# Altium schematic sheet MAGI'sRTC.SchDoc
size A4
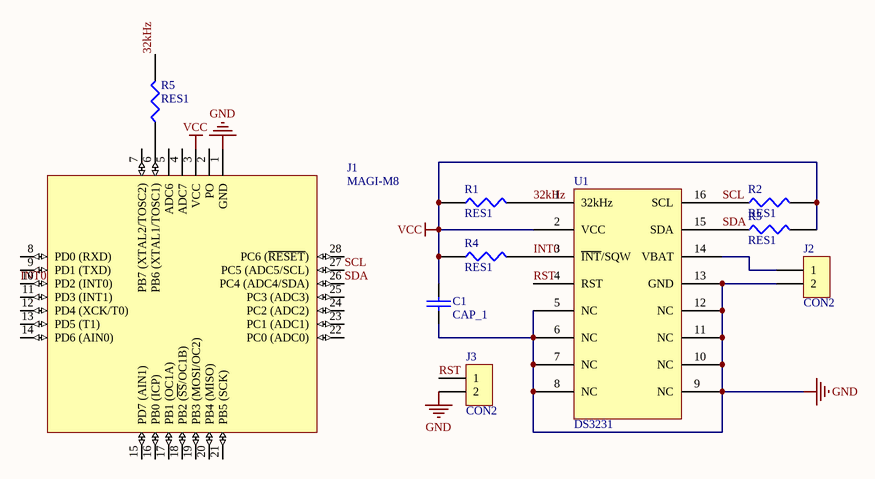
[diagram p0: MAGI'sRTC.SchDoc]

## Parts
C1  CAP_1  [6-0805_M]
J1  MAGI-M8  [MAGI-M8]
J2  CON2  [CR1220]
J3  CON2  [SW-1-SMD]
R1  RES1  [6-0805_N]
R2  RES1  [6-0805_N]
R3  RES1  [6-0805_N]
R4  RES1  [6-0805_N]
R5  RES1  [6-0805_N]
U1  DS3231  [DS3231]

## Nets
GND: C1.2 J1.1(GND) J2.2 J3.2 U1.5(NC) U1.6(NC) U1.7(NC) U1.8(NC) U1.9(NC) U1.10(NC) U1.11(NC) U1.12(NC) U1.13(GND)
VCC: C1.1 J1.3(VCC) R1.1 R2.2 R3.2 R4.1 U1.2(VCC)
32kHz: R1.2 R5.2 U1.1(32kHz)
INT0: J1.10(PD2_(INT0)) R4.2 U1.3(~{INT}/SQW)
RST: J3.1 U1.4(RST)
SCL: J1.27(PC5_(ADC5/SCL)) R2.1 U1.16(SCL)
SDA: J1.26(PC4_(ADC4/SDA)) R3.1 U1.15(SDA)
NetJ1_6: J1.6(PB6_(XTAL1/TOSC1)) R5.1
NetJ2_1: J2.1 U1.14(VBAT)

Not connected (* = marked no-connect by the designer): J1 2(PO) 4(ADC7) 5(ADC6) 7(PB7_(XTAL2/TOSC2)) 8(PD0_(RXD)) 9(PD1_(TXD)) 11(PD3_(INT1)) 12(PD4_(XCK/T0)) 13(PD5_(T1)) 14(PD6_(AIN0)) 15(PD7_(AIN1)) 16(PB0_(ICP)) 17(PB1_(OC1A)) 18(PB2_(~{SS}/OC1B)) 19(PB3_(MOSI/OC2)) 20(PB4_(MISO)) 21(PB5_(SCK)) 22(PC0_(ADC0)) 23(PC1_(ADC1)) 24(PC2_(ADC2)) 25(PC3_(ADC3)) 28(PC6_(~{RESET}))

## Library data of the parts
C1 = CAP_1: Capacitor
J2 J3 = CON2: Connector